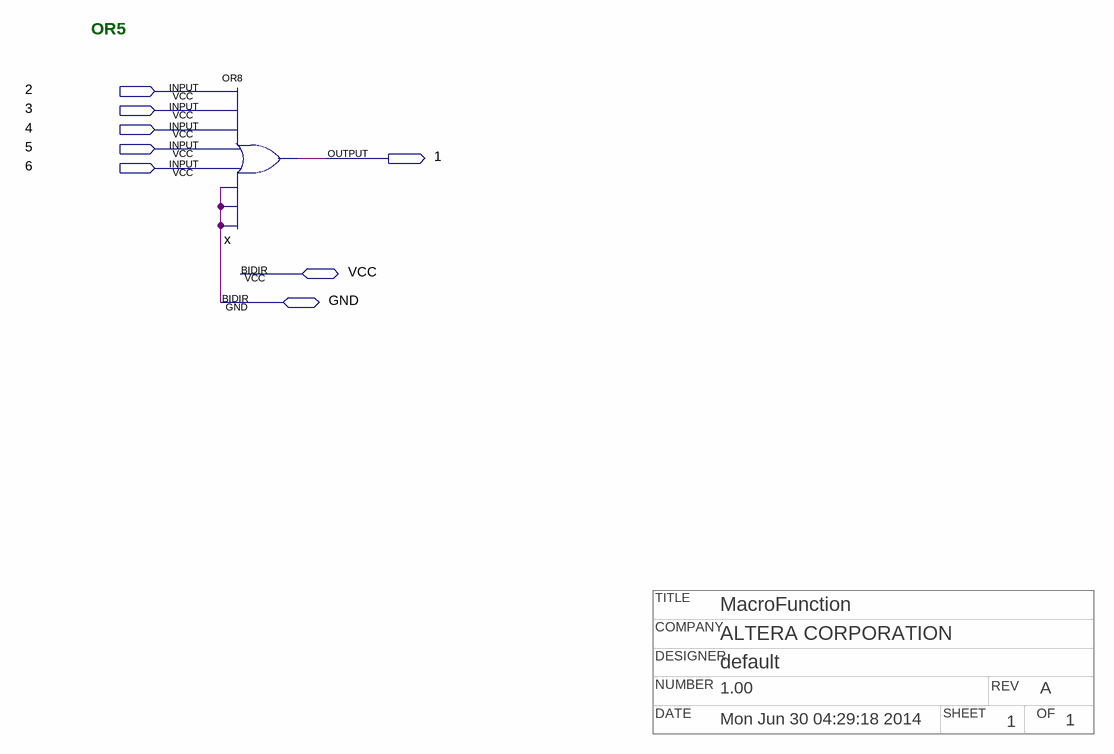
[diagram p0: schematic sheet]
// Quartus schematic npor5.bdf as structural Verilog: 1 symbols, 8 pins
// Title block: TITLE: MacroFunction; COMPANY: ALTERA CORPORATION; DESIGNER: default; NUMBER: 1.00; REV: A; DATE: Mon Jun 30 04:29:18 2014; SHEET: 1; OF: 1
module npor5 (
  input  \2 ,
  input  \3 ,
  input  \4 ,
  input  \5 ,
  input  \6 ,
  inout  VCC,
  inout  GND,
  output \1 
);

  or x (\1 , \2 , \3 , \4 , \5 , \6 , GND, GND, GND);

  // Notes on the sheet:
  //   OR5
endmodule
